# Altium project BeamActuatorDriverBoard.PrjPcb
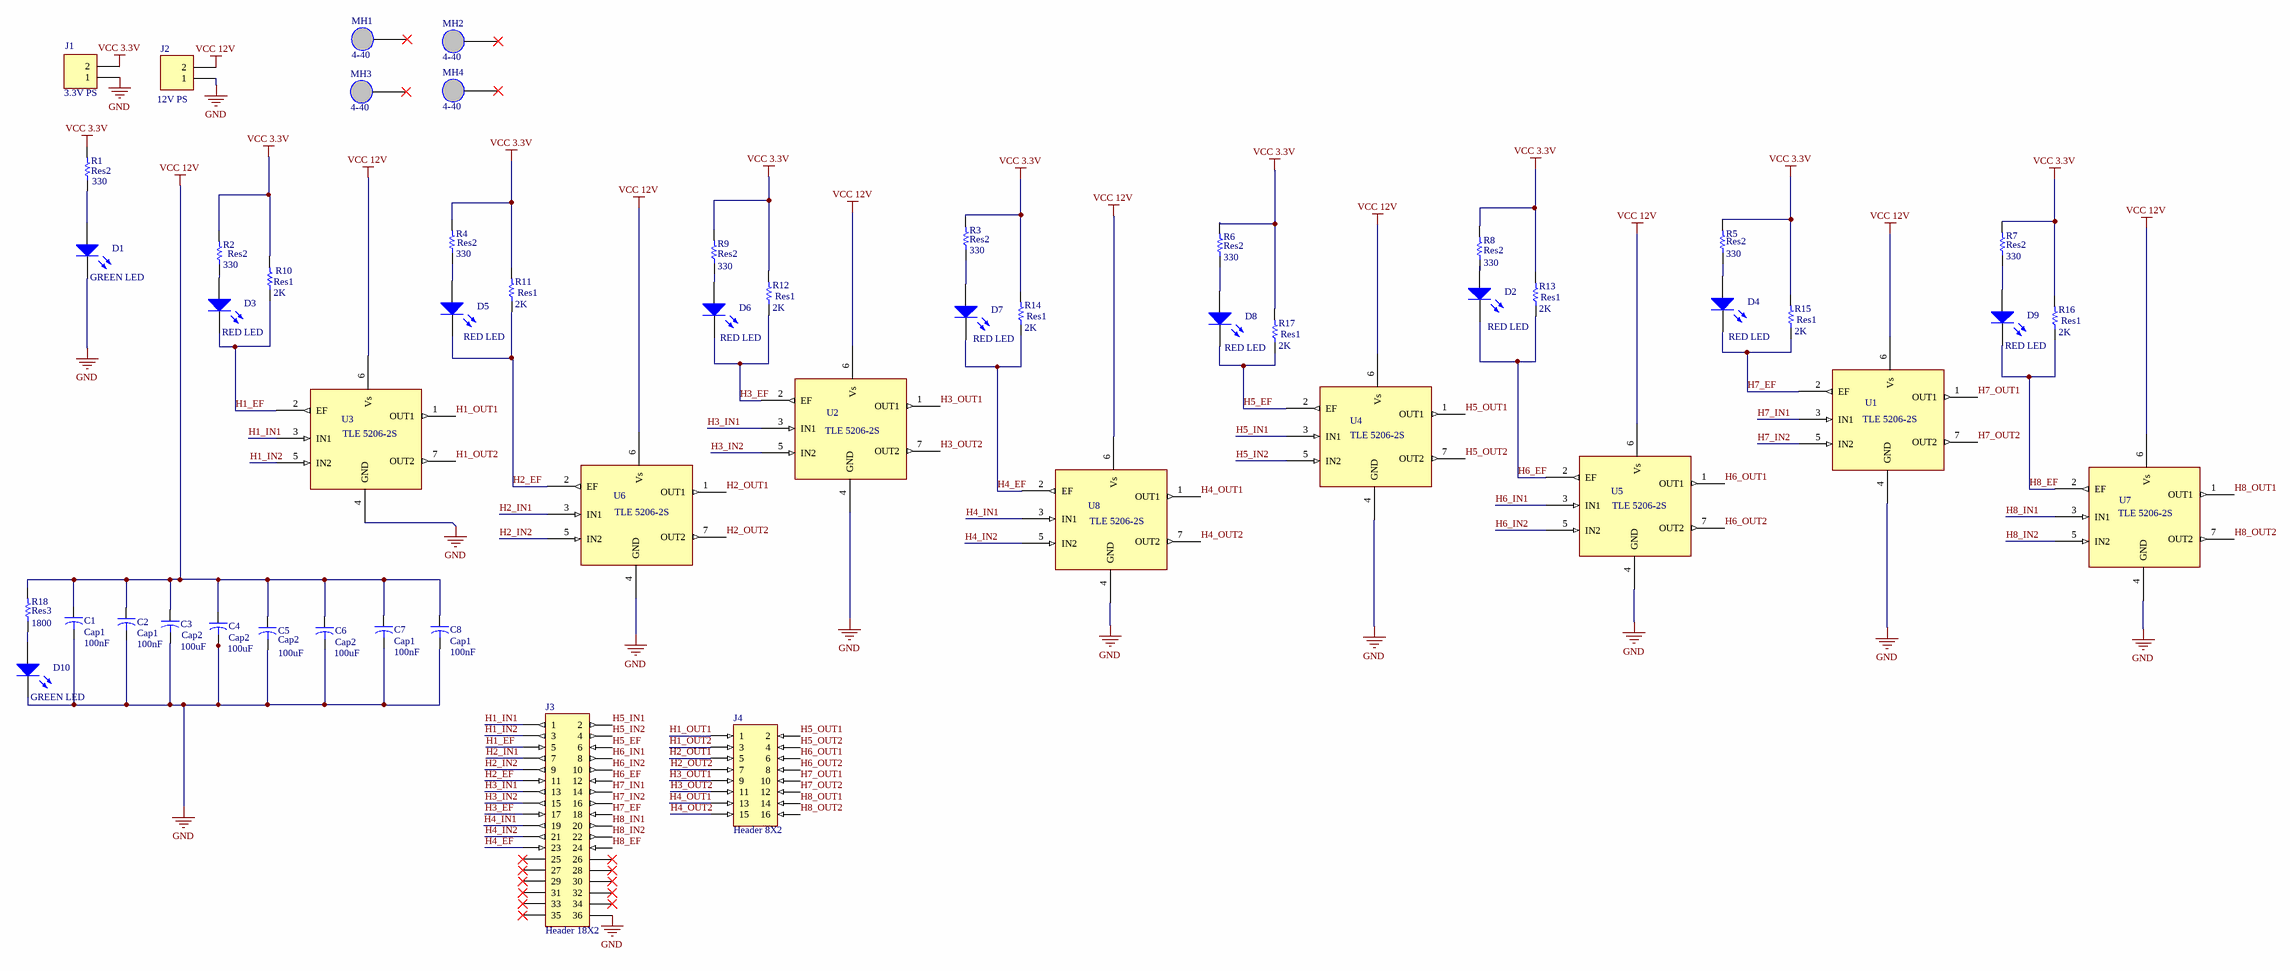
[diagram p0: Sheet1.SchDoc]
1 sheet, 52 parts. Net scope: global (net labels, ports and power ports of the same name join across sheets).
Board files: PCB1.PcbDoc, PCB1 -2Layer.PcbDoc

## Sheet Sheet1.SchDoc
size 558 x 431 mm; ApprovedBy: <Approver Name>; CheckedBy: <Checker Name>; CompanyName: NATIONAL AERONAUTICS AND SPACE ADMINISTRATION; DrawnBy: <Drafter Name>; Engineer: <Engineer Name>; Organization: LYNDON B. JOHNSON SPACE CENTER   HOUSTON, TEXAS; Address1: NASA Johnson Space Center; Address2: 2101 NASA Parkway; Address3: Houston Tx, 77058; DocumentNumber: <DocumentNumber>; PageSetup: Record=PageOptions|CenterHorizontal=True|CenterVertical=True|PrintScale=1.00|XCorrection=1.00|YCorrection=1.00|PrintKind=0|BorderSize=5000000|LeftOffset=0|BottomOffset=0|Orientation=1|PaperLength=1000|PaperWidth=1000|Scale=100|PaperSource=15|PrintQuality=1200|MediaType=1|DitherType=10|PaperKind=PostScript Custom Page Size|PrintScaleMode=0; Project: Project Name; Title1: Title Line 1; Title2: Title Line 2; Title3: Title Line 3; CageCode: 21356; OrgCode: <OrgCode>; NextAssembly: <Next Assembly>; DrawingType: <Ref. Table 3.2-1 of JPR8500>; AdditionalInfoLine1: <Additional Information Line 1>; AdditionalInfoLine2: <Additional Information Line 2>; Scale: N/A; FormatNumber: L26JUL07

### Parts
C1  Cap1  value 100nF  [CAPR5-4X5]
C2  Cap1  value 100nF  [CAPR5-4X5]
C3  Cap2  value 100uF  [CAPR5-4X5]
C4  Cap2  value 100uF  [CAPR5-4X5]
C5  Cap2  value 100uF  [CAPR5-4X5]
C6  Cap2  value 100uF  [CAPR5-4X5]
C7  Cap1  value 100nF  [CAPR5-4X5]
C8  Cap1  value 100nF  [CAPR5-4X5]
D1  GREEN LED  [LED-1]
D2  RED LED  [LED-1]
D3  RED LED  [LED-1]
D4  RED LED  [LED-1]
D5  RED LED  [LED-1]
D6  RED LED  [LED-1]
D7  RED LED  [LED-1]
D8  RED LED  [LED-1]
D9  RED LED  [LED-1]
D10  GREEN LED  [LED-1]
J1  3.3V PS  [HDR1X2]
J2  12V PS  [HDR1X2]
J3  Header 18X2  [HDR2X18]
J4  Header 8X2  [HDR2X8]
MH1  4-40  [MountHole4-40]
MH2  4-40  [MountHole4-40]
MH3  4-40  [MountHole4-40]
MH4  4-40  [MountHole4-40]
R1  Res2  value 330  [AXIAL-0.3]
R2  Res2  value 330  [AXIAL-0.3]
R3  Res2  value 330  [AXIAL-0.3]
R4  Res2  value 330  [AXIAL-0.3]
R5  Res2  value 330  [AXIAL-0.3]
R6  Res2  value 330  [AXIAL-0.3]
R7  Res2  value 330  [AXIAL-0.3]
R8  Res2  value 330  [AXIAL-0.3]
R9  Res2  value 330  [AXIAL-0.3]
R10  Res1  value 2K  [AXIAL-0.3]
R11  Res1  value 2K  [AXIAL-0.3]
R12  Res1  value 2K  [AXIAL-0.3]
R13  Res1  value 2K  [AXIAL-0.3]
R14  Res1  value 2K  [AXIAL-0.3]
R15  Res1  value 2K  [AXIAL-0.3]
R16  Res1  value 2K  [AXIAL-0.3]
R17  Res1  value 2K  [AXIAL-0.3]
R18  Res3  [AXIAL-0.3]
U1  TLE 5206-2S  [TLE 5206-2]
U2  TLE 5206-2S  [TLE 5206-2]
U3  TLE 5206-2S  [TLE 5206-2]
U4  TLE 5206-2S  [TLE 5206-2]
U5  TLE 5206-2S  [TLE 5206-2]
U6  TLE 5206-2S  [TLE 5206-2]
U7  TLE 5206-2S  [TLE 5206-2]
U8  TLE 5206-2S  [TLE 5206-2]

### Nets
GND: C1.2 C2.2 C3.2 C4.2 C5.2 C6.2 C7.2 C8.2 D1.2(K) D10.2(K) J1.1 J2.1 J3.36 U1.4(GND) U2.4(GND) U3.4(GND) U4.4(GND) U5.4(GND) U6.4(GND) U7.4(GND) U8.4(GND)
VCC 3.3V: J1.2 R1.2 R2.2 R3.2 R4.2 R5.2 R6.2 R7.2 R8.2 R9.2 R10.2 R11.2 R12.2 R13.2 R14.2 R15.2 R16.2 R17.2
VCC 12V: C1.1 C2.1 C3.1 C4.1 C5.1 C6.1 C7.1 C8.1 J2.2 R18.2 U1.6(Vs) U2.6(Vs) U3.6(Vs) U4.6(Vs) U5.6(Vs) U6.6(Vs) U7.6(Vs) U8.6(Vs)
H1_EF: D3.2(K) J3.5 R10.1 U3.2(EF)
H1_IN1: J3.1 U3.3(IN1)
H1_IN2: J3.3 U3.5(IN2)
H1_OUT1: J4.1 U3.1(OUT1)
H1_OUT2: J4.3 U3.7(OUT2)
H2_EF: D5.2(K) J3.11 R11.1 U6.2(EF)
H2_IN1: J3.7 U6.3(IN1)
H2_IN2: J3.9 U6.5(IN2)
H2_OUT1: J4.5 U6.1(OUT1)
H2_OUT2: J4.7 U6.7(OUT2)
H3_EF: D6.2(K) J3.17 R12.1 U2.2(EF)
H3_IN1: J3.13 U2.3(IN1)
H3_IN2: J3.15 U2.5(IN2)
H3_OUT1: J4.9 U2.1(OUT1)
H3_OUT2: J4.11 U2.7(OUT2)
H4_EF: D7.2(K) J3.23 R14.1 U8.2(EF)
H4_IN1: J3.19 U8.3(IN1)
H4_IN2: J3.21 U8.5(IN2)
H4_OUT1: J4.13 U8.1(OUT1)
H4_OUT2: J4.15 U8.7(OUT2)
H5_EF: D8.2(K) J3.6 R17.1 U4.2(EF)
H5_IN1: J3.2 U4.3(IN1)
H5_IN2: J3.4 U4.5(IN2)
H5_OUT1: J4.2 U4.1(OUT1)
H5_OUT2: J4.4 U4.7(OUT2)
H6_EF: D2.2(K) J3.12 R13.1 U5.2(EF)
H6_IN1: J3.8 U5.3(IN1)
H6_IN2: J3.10 U5.5(IN2)
H6_OUT1: J4.6 U5.1(OUT1)
H6_OUT2: J4.8 U5.7(OUT2)
H7_EF: D4.2(K) J3.18 R15.1 U1.2(EF)
H7_IN1: J3.14 U1.3(IN1)
H7_IN2: J3.16 U1.5(IN2)
H7_OUT1: J4.10 U1.1(OUT1)
H7_OUT2: J4.12 U1.7(OUT2)
H8_EF: D9.2(K) J3.24 R16.1 U7.2(EF)
H8_IN1: J3.20 U7.3(IN1)
H8_IN2: J3.22 U7.5(IN2)
H8_OUT1: J4.14 U7.1(OUT1)
H8_OUT2: J4.16 U7.7(OUT2)
NetD1_1: D1.1(A) R1.1
NetD2_1: D2.1(A) R8.1
NetD3_1: D3.1(A) R2.1
NetD4_1: D4.1(A) R5.1
NetD5_1: D5.1(A) R4.1
NetD6_1: D6.1(A) R9.1
NetD7_1: D7.1(A) R3.1
NetD8_1: D8.1(A) R6.1
NetD9_1: D9.1(A) R7.1
NetD10_1: D10.1(A) R18.1

Not connected (* = marked no-connect by the designer): J3 25* 26* 27* 28* 29* 30* 31* 32* 33* 34* 35*; MH1 0*; MH2 0*; MH3 0*; MH4 0*

### Notes on the sheet
- 4
- 3
- 2
- 1
- REV
- ZONE
- DESCRIPTION OF CHANGE
- REVISIONS
- D
- C
- B
- UNLESS NOTED OTHERWISE
  DIM ARE IN INCHES, TOL ARE:
- .00
- .0
- 0.1
- 0.02
- ANGULAR
- .000
- 0.005
- 0.5
- DR
- SIGNATURES
- DATE
- A
- SURFACE FINISH IN
  MICROINCHES RMS UNLESS
  NOTED OTHERWISE
- ENG
- CH
- APP
- NEXT ASSY
- QE
- MATL
- PROJECT
- DRAWING TYPE
- STRESS
- AUTH
- SIZE
- SCALE
- CAGE CODE
- ORG
- DWG NO.
- FMT
- SHEET
- OF

### Library data of the parts
C1-C8 = Cap2: Capacitor; Published: 23-Sep-2002; PackageReference: CAPR5-4X5; Publisher: Altium Limited; PackageDescription: Capacitor; 2 Leads
D1-D10 = LED1: Typical RED GaAs LED; Published: 8-Jun-2000; LatestRevisionDate: 08-Jul-2005; LatestRevisionNote: Mech Layer 1 removed.; PackageReference: LED-1; Publisher: Altium Limited; PackageDescription: LED; 2 Leads
J1 J2 = Header 2: Header, 2-Pin; LatestRevisionDate: 17-Jul-2002; LatestRevisionNote: Re-released for DXP Platform.; Publisher: Altium Limited
J3 = Header 18X2: Header, 18-Pin, Dual row; LatestRevisionDate: 17-Jul-2002; LatestRevisionNote: Re-released for DXP Platform.; Publisher: Altium Limited
J4 = Header 8X2: Header, 8-Pin, Dual row; LatestRevisionDate: 17-Jul-2002; LatestRevisionNote: Re-released for DXP Platform.; Publisher: Altium Limited
MH1-MH4 = Mounting Hole 4-40
R1-R18 = Res1: Resistor; Published: 8-Jun-2000; LatestRevisionDate: 17-Jul-2002; LatestRevisionNote: Re-released for DXP Platform.; PackageReference: AXIAL-0.3; Publisher: Altium Limited; PackageDescription: Axial Device, Thru-Hole; 2 Leads; 0.3 in Pin Spacing
U1-U8 = TLE 5206-2S: Infineon TLE 5206-2S Hbridge